# EAGLE design WifiDriverREV3 (EAGLE 9.6.2)
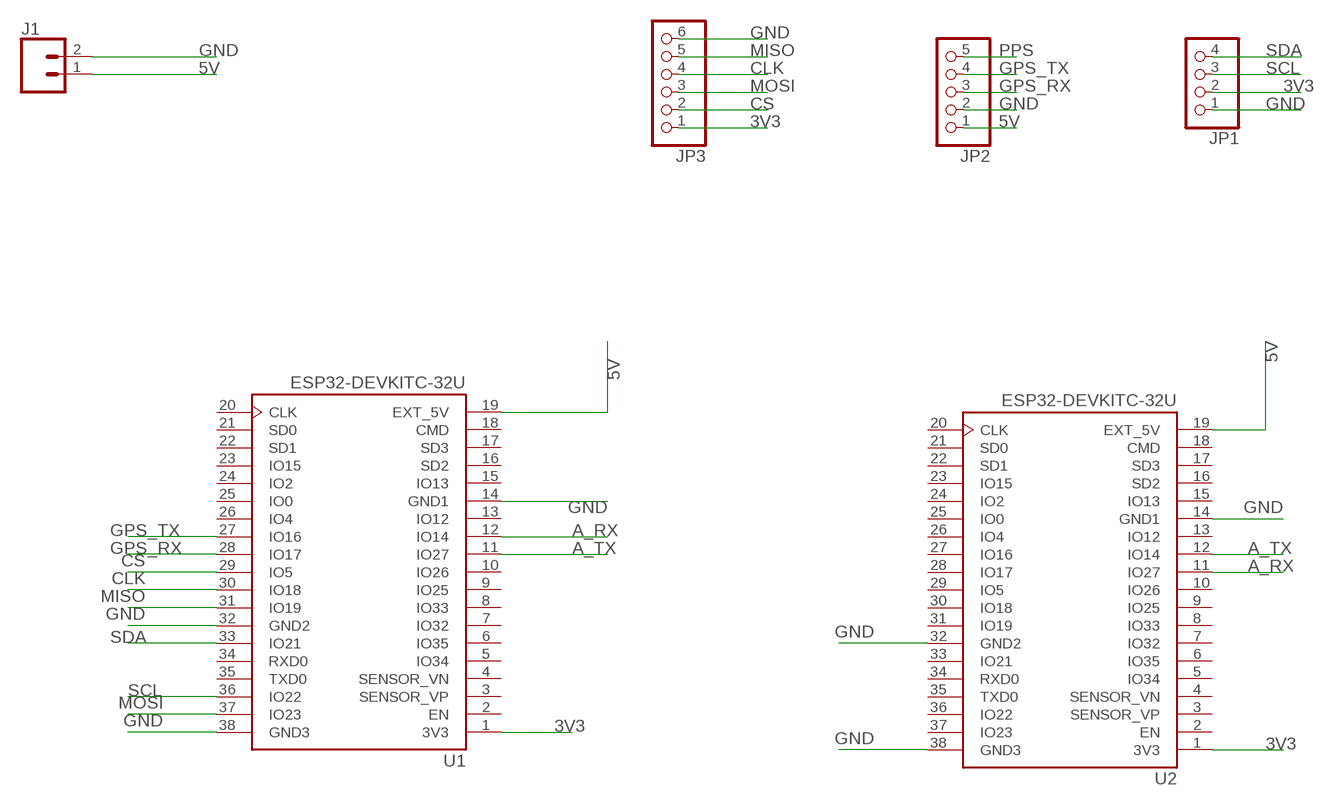
[diagram p0: schematic, sheet 1]

## Parts
J1  CONN_023.5MM_LOCK  [SCREWTERMINAL-3.5MM-2_LOCK]
JP1  PINHD-1X4  [1X04]
JP2  PINHD-1X5  [1X05]
JP3  PINHD-1X6  [1X06]
U1  ESP32-DEVKITC-32U  [MODULE_ESP32-DEVKITC-32U]
U2  ESP32-DEVKITC-32U  [MODULE_ESP32-DEVKITC-32U]

## Nets
3V3: JP1.2 JP3.1 U1.1(3V3) U2.1(3V3)
5V: J1.1 JP2.1 U1.19(EXT_5V) U2.19(EXT_5V)
A_RX: U1.12(IO14) U2.11(IO27)
A_TX: U1.11(IO27) U2.12(IO14)
CLK: JP3.4 U1.30(IO18)
CS: JP3.2 U1.29(IO5)
GND: J1.2 JP1.1 JP2.2 JP3.6 U1.14(GND1) U1.32(GND2) U1.38(GND3) U2.14(GND1) U2.32(GND2) U2.38(GND3)
GPS_RX: JP2.3 U1.28(IO17)
GPS_TX: JP2.4 U1.27(IO16)
MISO: JP3.5 U1.31(IO19)
MOSI: JP3.3 U1.37(IO23)
PPS: JP2.5
SCL: JP1.3 U1.36(IO22)
SDA: JP1.4 U1.33(IO21)
Unconnected: U1.2(EN) U1.3(SENSOR_VP) U1.4(SENSOR_VN) U1.5(IO34) U1.6(IO35) U1.7(IO32) U1.8(IO33) U1.9(IO25) U1.10(IO26) U1.13(IO12) U1.15(IO13) U1.16(SD2) U1.17(SD3) U1.18(CMD) U1.20(CLK) U1.21(SD0) U1.22(SD1) U1.23(IO15) U1.24(IO2) U1.25(IO0) U1.26(IO4) U1.34(RXD0) U1.35(TXD0) U2.2(EN) U2.3(SENSOR_VP) U2.4(SENSOR_VN) U2.5(IO34) U2.6(IO35) U2.7(IO32) U2.8(IO33) U2.9(IO25) U2.10(IO26) U2.13(IO12) U2.15(IO13) U2.16(SD2) U2.17(SD3) U2.18(CMD) U2.20(CLK) U2.21(SD0) U2.22(SD1) U2.23(IO15) U2.24(IO2) U2.25(IO0) U2.26(IO4) U2.27(IO16) U2.28(IO17) U2.29(IO5) U2.30(IO18) U2.31(IO19) U2.33(IO21) U2.34(RXD0) U2.35(TXD0) U2.36(IO22) U2.37(IO23)

## Library data of the parts
J1 = SparkFun-Connectors:CONN_02: Multi connection point. Often used as Generic Header-pin footprint for 0.1 inch spaced/style header connections On any of the 0.1 inch spaced packages, you can populate with these: Break Away Headers - Straight <https://www.sparkfun.com/products/116> (PRT-00116) Break Away Male Headers - Right Angle <https://www.sparkfun.com/products/553> (PRT-00553) Female Headers <https://www.sparkfun.com/products/115> (PRT-00115) Break Away Headers - Machine Pin <https://www.sparkfun.com/products/117> (PRT-00117) Break Away Female Headers - Swiss Machine Pin <https://www.sparkfun.com/products/743> (PRT-00743) For SCREWTERMINALS and SPRING TERMINALS visit here: Screw Terimnals on SparkFun.com <https://www.sparkfun.com/search/results?term=Screw+Terminals> (5mm/3.5mm/2.54mm spacing) This device is also useful as a general connection point to wire up your design to another part of your project. Our various solder wires solder well into these plated through hole pads. Hook-Up Wire - Assortment (Stranded, 22 AWG) <https://www.sparkfun.com/products/11375> (PRT-11375) Hook-Up Wire - Assortment (Solid Core, 22 AWG) <https://www.sparkfun.com/products/11367> (PRT-11367) View the entire wire category on our website here <https://www.sparkfun.com/categories/141> Special notes: Molex polarized connector foot print use with: PRT-08233 with associated crimp pins and housings. 2.54_SCREWTERM for use with PRT-10571. 3.5mm Screw Terminal footprints for PRT-08084 5mm Screw Terminal footprints for use with PRT-08432; PROD_ID: CONN-08399
JP1 = pinhead:PINHD-1X4: PIN HEADER
JP2 = pinhead:PINHD-1X5: PIN HEADER
JP3 = pinhead:PINHD-1X6: PIN HEADER
U1 U2 = ESP32-DEVKITC-32U:ESP32-DEVKITC-32U: ESP32-DEVKITC Check availability <https://pricing.snapeda.com/parts/ESP32-DEVKITC-32U/Espressif%20Systems/view-part?ref=eda>; AVAILABILITY: In Stock; DESCRIPTION: ESP32-WROOM-32UE series Transceiver; 802.11 b/g/n (Wi-Fi, WiFi, WLAN), Bluetooth® Smart Ready 4.x Dual Mode Evaluation Board; MF: Espressif Systems; MP: ESP32-DEVKITC-32U; PACKAGE: CUSTOM-38 ESPRESSIF; PRICE: None

## Board
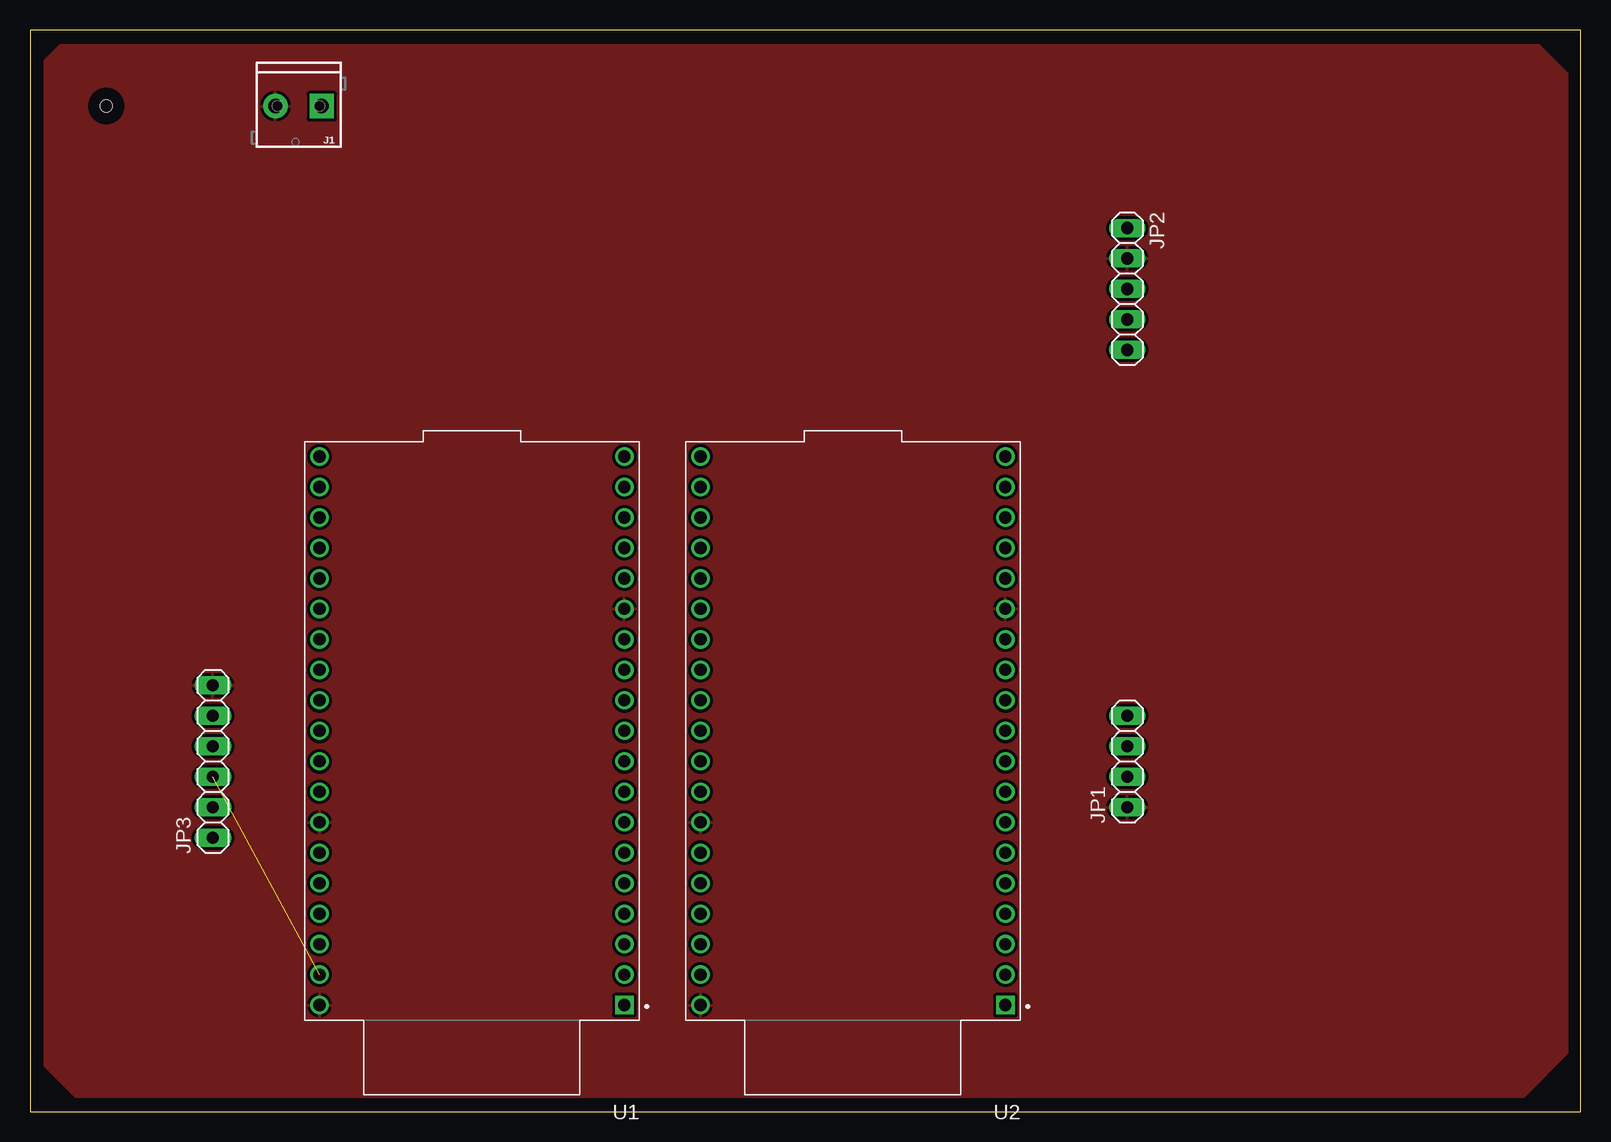
[diagram p1: board, top side]
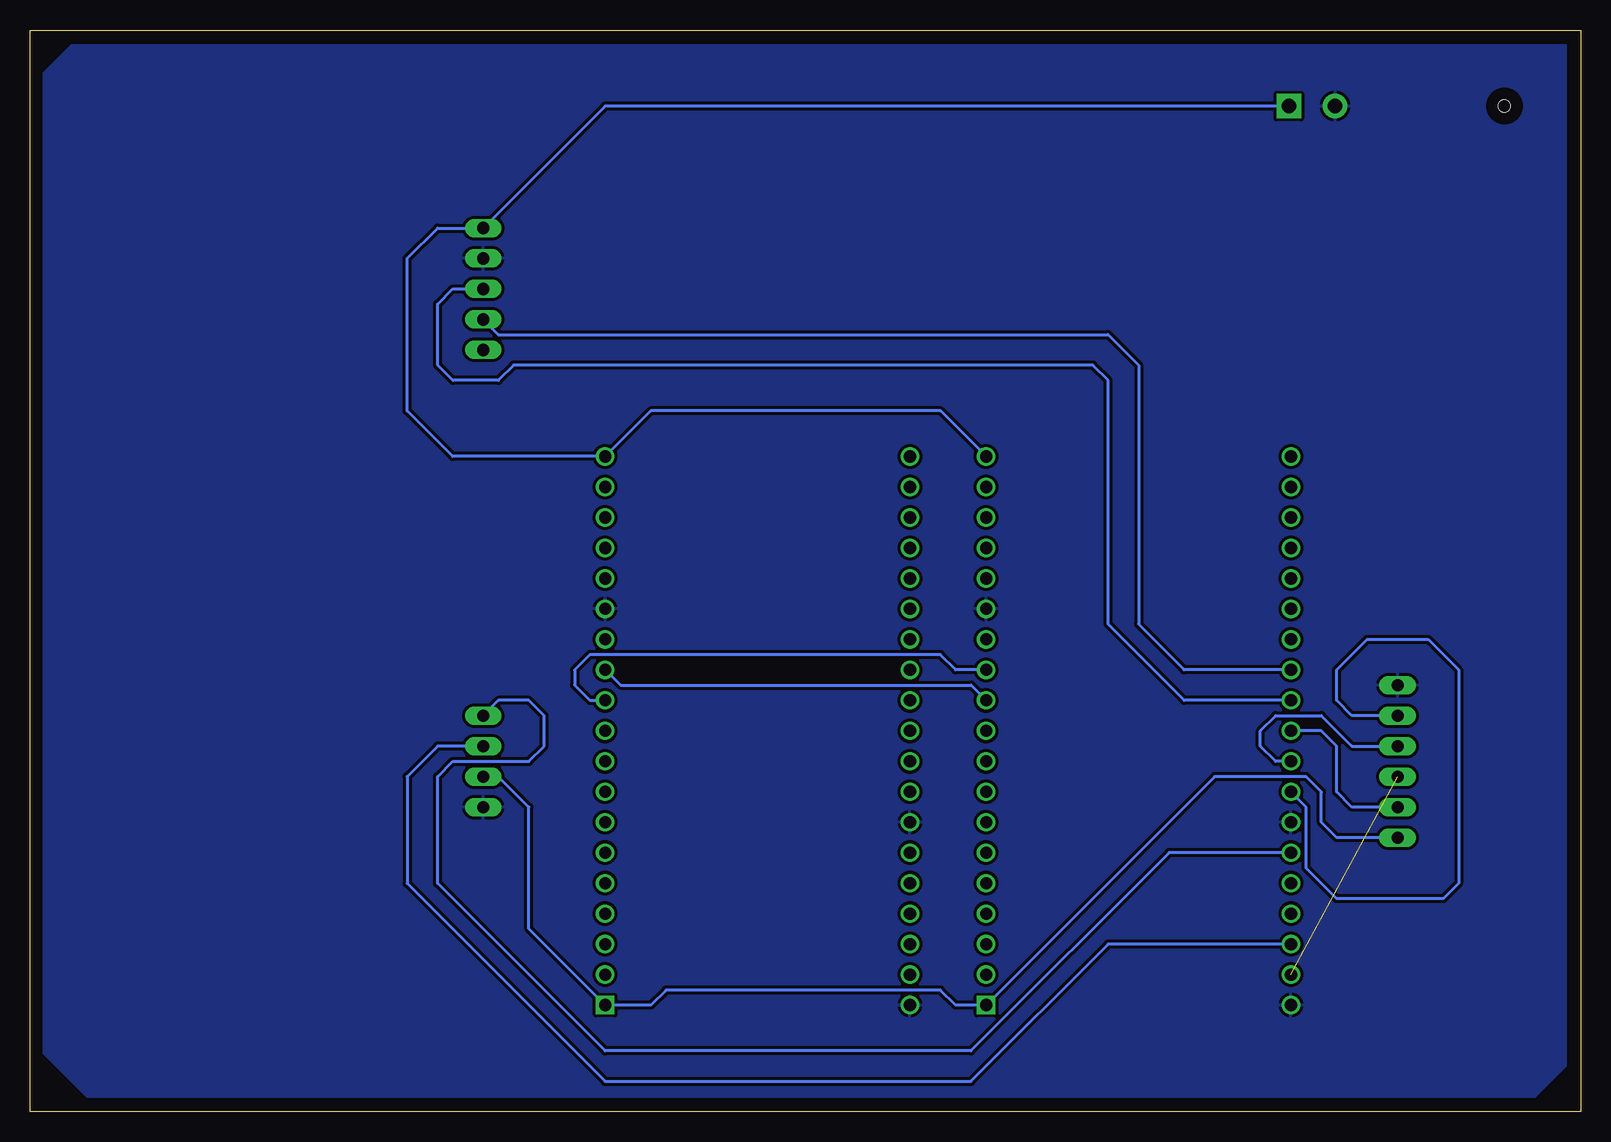
[diagram p2: board, bottom side, seen from below]

Size 129.21 x 90.16 mm. Coordinates in mm from the lower left corner, seen from the top.
Outline: 0,0 129.21,0 129.21,90.16 0,90.16 0,0
Copper layers (1*16): Top 0.035mm / dielectric 1.5mm / Bottom 0.035mm
Design rules "default": minimum track width 6mil, minimum drill 0.35mm, track to track 6mil, track to pad 6mil, pad to pad 6mil, via to via 6mil, smd to smd 6mil, copper to edge 40mil, drill to drill 6mil, minimum pad ring 10mil, minimum via ring 8mil, stop-mask expansion 4mil, vias tented up to drill 0mil, thermal gap 10mil
Holes 1 mm at 6.35,83.82

### Footprints (pad centres in the part's own frame; a part is rotated, then mirrored left to right if it is on the bottom)
SCREWTERMINAL-3.5MM-2_LOCK = drill 1.2 pad 2.032 square: 1 -0.178,0 | drill 1.2 pad 2.032: 2 3.678,0
1X04 = drill 1.016 long: 1 -3.81,0; 2 -1.27,0; 3 1.27,0; 4 3.81,0
1X05 = drill 1.016 long: 1 -5.08,0; 2 -2.54,0; 3 0,0; 4 2.54,0; 5 5.08,0
1X06 = drill 1.016 long: 1 -6.35,0; 2 -3.81,0; 3 -1.27,0; 4 1.27,0; 5 3.81,0; 6 6.35,0
MODULE_ESP32-DEVKITC-32U = drill 1.02 square: 1 -12.7,22.85 | drill 1.02: 2 -12.7,20.31; 3 -12.7,17.77; 4 -12.7,15.23; 5 -12.7,12.69; 6 -12.7,10.15; 7 -12.7,7.61; 8 -12.7,5.07; 9 -12.7,2.53; 10 -12.7,-0.01; 11 -12.7,-2.55; 12 -12.7,-5.09; 13 -12.7,-7.63; 14 -12.7,-10.17; 15 -12.7,-12.71; 16 -12.7,-15.25; 17 -12.7,-17.79; 18 -12.7,-20.33; 19 -12.7,-22.87; 20 12.7,-22.87; 21 12.7,-20.33; 22 12.7,-17.79; 23 12.7,-15.25; 24 12.7,-12.71; 25 12.7,-10.17; 26 12.7,-7.63; 27 12.7,-5.09; 28 12.7,-2.55; 29 12.7,-0.01; 30 12.7,2.53; 31 12.7,5.07; 32 12.7,7.61; 33 12.7,10.15; 34 12.7,12.69; 35 12.7,15.23; 36 12.7,17.77; 37 12.7,20.31; 38 12.7,22.85

### Placement (x,y rotation side)
J1  24.13,83.82 180 top
JP1  91.44,29.21 90 top
JP2  91.44,68.58 270 top
JP3  15.24,29.21 90 top
U1  36.83,31.75 180 top
U2  68.58,31.75 180 top

### Tracks (layer width: path | path; a pad name or v marks a point on that pad's centre or on a via)
3V3
  Bottom 0.254: JP3.1 20.32,22.86 21.59,24.13 21.59,26.67 22.86,27.94 30.49,27.94 U1.1 52.08,8.9 53.34,10.16 76.2,10.16 77.47,8.89 U2.1 87.63,15.25 87.63,25.4 90.17,27.94 JP1.2
5V
  Bottom 0.254: U1.19 53.33,58.42 77.48,58.42 U2.19 93.99,54.62 97.79,58.42 97.79,71.12 95.25,73.66 JP2.1 81.28,83.82 J1.1
A_RX
  Bottom 0.254: U1.12 52.08,36.84 53.34,38.1 82.55,38.1 83.82,36.83 83.82,35.56 82.55,34.29 U2.11
A_TX
  Bottom 0.254: U2.12 80,35.56 50.79,35.56 U1.11
CLK
  Bottom 0.254: U1.30 25.41,29.22 26.67,30.48 26.67,31.75 25.4,33.02 21.59,33.02 19.05,30.48 JP3.4
CS
  Bottom 0.254: JP3.2 19.05,25.4 20.32,26.67 20.32,30.48 21.6,31.76 U1.29
GND
  pour Bottom (isolate 0.254): 1.27,88.9 1.27,3.81 3.81,1.27 124.46,1.27 128.27,5.08 128.27,86.36 125.73,88.9
  pour Top (isolate 0.254): 1.27,87.63 2.54,88.9 125.73,88.9 128.27,86.36 128.27,5.08 124.46,1.27 3.81,1.27 1.27,3.81
GPS_RX
  Bottom 0.254: U1.28 33.03,34.3 39.37,40.64 39.37,60.96 40.64,62.23 88.9,62.23 90.17,60.96 93.98,60.96 95.25,62.23 95.25,67.31 93.98,68.58 JP2.3
GPS_TX
  Bottom 0.254: U1.27 33.03,36.84 36.83,40.64 36.83,62.23 39.37,64.77 90.17,64.77 JP2.4
MISO
  Bottom 0.254: JP3.5 19.05,33.02 20.32,34.29 20.32,36.83 17.78,39.37 12.7,39.37 10.16,36.83 10.16,19.05 11.43,17.78 20.32,17.78 22.86,20.32 22.86,25.41 U1.31
MOSI  (1 unrouted)
  Bottom 0.254: U1.37
SCL
  Bottom 0.254: U1.36 39.36,13.98 50.8,2.54 81.28,2.54 97.79,19.05 97.79,27.94 95.25,30.48 JP1.3
SDA
  Bottom 0.254: U1.33 34.28,21.6 50.8,5.08 81.28,5.08 95.25,19.05 95.25,27.94 93.98,29.21 87.63,29.21 86.36,30.48 86.36,33.02 87.63,34.29 90.17,34.29 JP1.4